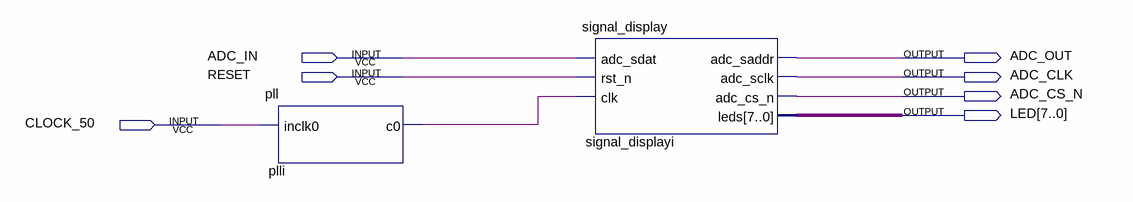
[diagram p0: schematic sheet]
// Quartus schematic toplevel.bdf as structural Verilog: 2 symbols, 7 pins
module toplevel (
  input  ADC_IN,
  input  RESET,
  input  CLOCK_50,
  output ADC_OUT,
  output ADC_CLK,
  output ADC_CS_N,
  output [7:0] LED
);

  wire plli_c0;

  pll plli (.inclk0(CLOCK_50), .c0(plli_c0));
  signal_display signal_displayi (
    .adc_sdat(ADC_IN), .rst_n(RESET), .clk(plli_c0), .adc_saddr(ADC_OUT), .adc_sclk(ADC_CLK),
    .adc_cs_n(ADC_CS_N), .leds(LED));
endmodule
